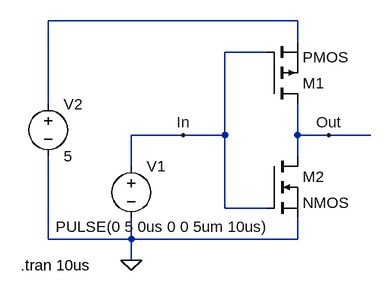
[diagram p0: schematic NearIdealInverter.asc]
NearIdealInverter.asc, the LTspice schematic file:
Version 4
SHEET 1 880 680
WIRE 208 -48 -176 -48
WIRE 208 -16 208 -48
WIRE 160 0 96 0
WIRE -176 80 -176 -48
WIRE 32 128 -48 128
WIRE 96 128 96 0
WIRE 96 128 32 128
WIRE 208 128 208 80
WIRE 256 128 208 128
WIRE 320 128 256 128
WIRE 208 160 208 128
WIRE -48 176 -48 128
WIRE 96 240 96 128
WIRE 160 240 96 240
WIRE -176 288 -176 160
WIRE -48 288 -48 256
WIRE -48 288 -176 288
WIRE 208 288 208 256
WIRE 208 288 -48 288
WIRE -48 320 -48 288
FLAG -48 320 0
FLAG 32 128 In
FLAG 256 128 Out
SYMBOL pmos 160 80 M180
SYMATTR InstName M1
SYMBOL nmos 160 160 R0
SYMATTR InstName M2
SYMBOL voltage -48 160 R0
WINDOW 3 -116 109 Left 2
WINDOW 123 0 0 Left 0
WINDOW 39 0 0 Left 0
SYMATTR InstName V1
SYMATTR Value PULSE(0 5 0us 0 0 5um 10us)
SYMBOL voltage -176 64 R0
WINDOW 123 0 0 Left 0
WINDOW 39 24 124 Left 2
SYMATTR InstName V2
SYMATTR Value 5
TEXT -218 328 Left 2 !.tran 10us

The netlist it stands for:
* NearIdealInverter.asc
M1 Out In N001 N001 PMOS
M2 Out In 0 0 NMOS
V1 In 0 PULSE(0 5 0us 0 0 5um 10us)
V2 N001 0 5
.model NMOS NMOS
.model PMOS PMOS
.lib standard.mos
.tran 10us
.backanno
.end